# EAGLE board ESP32_C6_Sparrow (EAGLE 9.7.0)
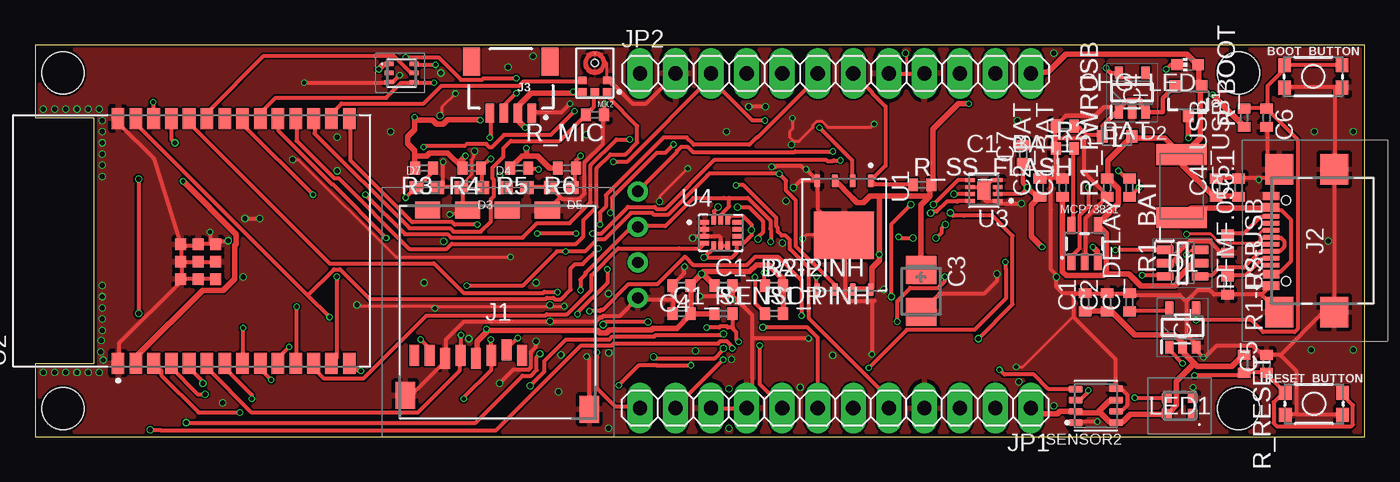
[diagram p1: board, top side]
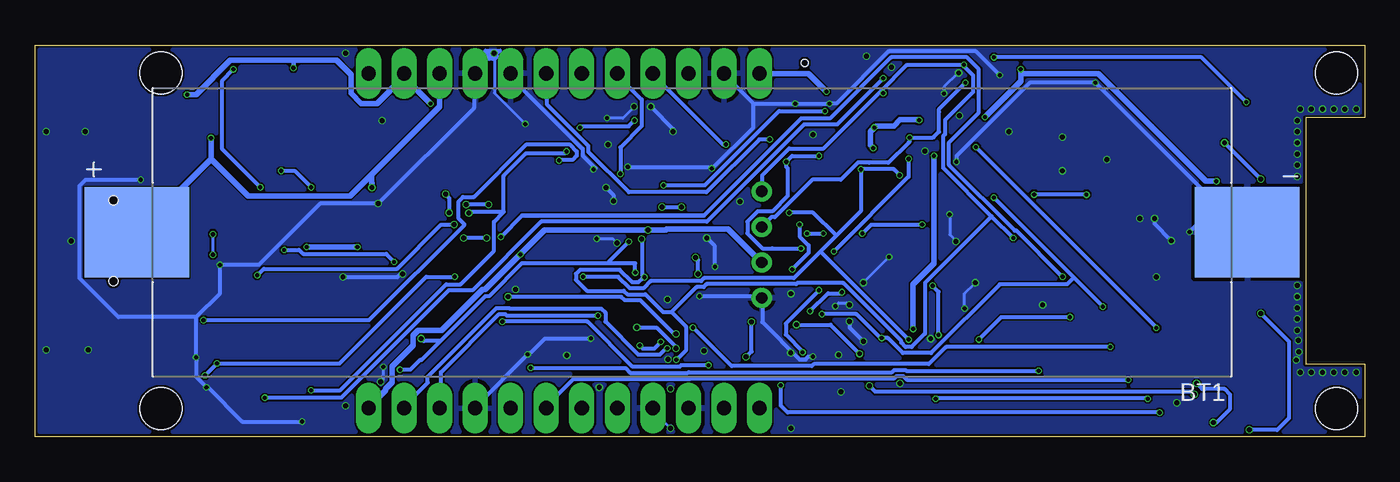
[diagram p2: board, bottom side, seen from below]

Size 95 x 28 mm. Coordinates in mm from the lower left corner, seen from the top.
Outline: 0,28 0,22.8 4.2,22.8 4.2,5.2 0,5.2 0,0 95,0 95,28 0,28
Copper layers (1*16): Top / Bottom
Stack-up Default Layer Stack: Top User Defined 0.035mm / Dielectric-1 User Defined 1.6mm / Bottom User Defined 0.035mm
Design rules: minimum copper width classes=1 0.2mm, minimum copper width 5mil, minimum drill size classes=1 0.3mm, minimum drill size 0.3mm, copper clearance wire_polygon to wire_polygon 5mil, copper clearance wire_polygon to pad_smd 5mil, copper clearance wire_polygon to via 5mil, copper clearance pad_smd to pad_smd 5mil, copper clearance pad_smd to via 5mil, copper clearance via to via 5mil, copper clearance smd to pad (same net) 5mil, copper clearance smd to via (same net) 5mil, copper clearance smd to smd (same net) 5mil, dimension clearance 0.1mm, via restrict clearance 0mil, restrict clearance 0mil, drill distance 6mil, keepout clearance 0mil
Net classes: 1 HIGH_CURRENT: width 0.2 mm, drill 0.3 mm
Holes 3 mm at 2,26 86,26 86,2 2,2

## Footprints (pad centres in the part's own frame; a part is rotated, then mirrored left to right if it is on the bottom)
ESP32_WROVER_SPARKFUN-SWITCHES_TACTILE_SWITCH_SMD_4.6X2.8MM = smd 0.9 x 1: 1 -2.05,-0.8; 2 2.05,-0.8; 3 2.05,0.8; 4 -2.05,0.8
BAT_1042P = smd 7.46 x 6.47: N -39.67,0; P 39.67,0
ESP32_WROVER_EAGLE-LTSPICE_C0402 = smd 0.7 x 0.9: 1 -0.65,0; 2 0.65,0
RCL_CT3528 = smd 2 x 2.2: + -1.5,0; - 1.5,0
ADAFRUIT_CHIP-LED0603 = smd 0.8 x 0.8: A 0,-0.75; C 0,0.75
SOT95P280X145-6N = smd 1.2 x 0.6: 1 -1.25,0.95; 2 -1.25,0; 3 -1.25,-0.95; 4 1.25,-0.95; 5 1.25,0; 6 1.25,0.95
ESP32_WROVER_AVX---SD0805S020S1R0_AVX_SD0805S020S1R0_0 = smd 0.8 x 0.9: 1 -1.05,0; 2 1.05,0
DIOC1608X36N = smd 0.97 x 0.94: 1 -0.75,0; 2 0.75,0
SOT95P280X125-5N = smd 0.9 x 0.6: 1 -1.4,0.95; 2 -1.4,0; 3 -1.4,-0.95; 4 1.4,-0.95; 5 1.4,0.95
SOT95P280X120-5N = smd 0.9 x 0.6: 1 -1.4,0.95; 2 -1.4,0; 3 -1.4,-0.95; 4 1.4,-0.95; 5 1.4,0.95
SAMACSYS_PARTS_112ATAARR03ATTEND = smd 1.8 x 1.2: G1 10.6,10.4; G2 4.9,10.4; S1 7.75,10.4; S2 2.05,10.4 | smd 1.4 x 1.9: G3 13.6,-3.85; G4 0.45,-2.85 | smd 0.7 x 1.5: P1 8.8,0; P2 7.7,0.4; P3 6.6,0; P4 5.5,-0.2; P5 4.4,0; P6 3.3,-0.2; P7 2.2,0; P8 1.1,0
SAMACSYS_PARTS_USB4110GFA = smd 0.3 x 1.15: A1 -3.35,3.678; A4 -2.55,3.678; A5 -1.25,3.678; A6 -0.25,3.678; A7 0.25,3.678; A8 1.25,3.678; A9 2.55,3.678; A12 3.35,3.678; B1 3.05,3.678; B4 2.25,3.678; B5 1.75,3.678; B6 0.75,3.678; B7 -0.75,3.678; B8 -1.75,3.678; B9 -2.25,3.678; B12 -3.05,3.678 | smd 2.18 x 2: MP1 -5.11,-0.827; MP2 5.11,-0.827; MP3 -5.11,3.103; MP4 5.11,3.103 | hole 0.65: -2.89,2.603; 2.89,2.603
JST04_1MM_RA = smd 0.6 x 1.35: 1 -1.5,0; 2 -0.5,0; 3 0.5,0; 4 1.5,0 | smd 1.2 x 2: NC1 2.8,-3.675; NC2 -2.8,-3.675
1X12 = drill 1.016 long: 1 -13.97,0; 2 -11.43,0; 3 -8.89,0; 4 -6.35,0; 5 -3.81,0; 6 -1.27,0; 7 1.27,0; 8 3.81,0; 9 6.35,0; 10 8.89,0; 11 11.43,0; 12 13.97,0
SAMACSYS_PARTS_WS2812B2020 = smd 0.7 x 0.7: 1 0.915,-0.55; 2 0.915,0.55; 3 -0.915,0.55; 4 -0.915,-0.55
ESP32_WROVER_SAMACSYS_PARTS_LTR303ALS01 = smd 0.3 x 0.65: 1 -0.65,-0.9; 2 0,-0.9; 3 0.65,-0.9; 4 0.65,0.9; 5 0,0.9; 6 -0.65,0.9
ESP32_WROVER_SPARKFUN-IC-POWER_SOT23-5 = smd 0.55 x 1.2: 1 -0.95,-1.3; 2 0,-1.3; 3 0.95,-1.3; 4 0.95,1.3; 5 -0.95,1.3
MIC_ICS-43434 = smd 0.6 x 0.522: 1 -0.9,1.361; 2 -0.9,0.539; 4 0.9,0.539; 5 0.9,1.361; 6 0,1.361 | smd 0.1 x 0.1: 3 -0.015,-1.383 | hole 0.5: 0,-0.713
ESP32C6_VARISTOR_CT/CN1812 = smd 1.5 x 3.6: 1 -2.25,0; 2 2.25,0
ESP32_WROVER_SPARKFUN-DISCRETESEMI_SOT23-3 = smd 0.8 x 0.9: 1 -0.95,-1; 2 0.95,-1; 3 0,1.1
ESP32_WROVER_EAGLE-LTSPICE_R0402 = smd 0.7 x 0.9: 1 -0.65,0; 2 0.65,0
ESP32_WROVER_BME680_PSON80P300X300X100-8N = smd 1.016 x 0.5: 1 1.458,1.2; 2 1.458,0.4; 3 1.458,-0.4; 4 1.458,-1.2; 5 -1.458,-1.22; 6 -1.458,-0.4; 7 -1.458,0.4; 8 -1.458,1.2
SON127P600X800X80-9N = smd 0.94 x 0.44: 1 -3.895,1.905; 2 -3.895,0.635; 3 -3.895,-0.635; 4 -3.895,-1.905; 5 3.895,-1.905; 6 3.895,-0.635; 7 3.895,0.635; 8 3.895,1.905 | smd 3.4 x 4.3: 9 0,0
XCVR_ESP32-C6-WROOM-1-N8 = smd 1.5 x 0.9: 1 -8.75,5.26; 2 -8.75,3.99; 3 -8.75,2.72; 4 -8.75,1.45; 5 -8.75,0.18; 6 -8.75,-1.09; 7 -8.75,-2.36; 8 -8.75,-3.63; 9 -8.75,-4.9; 10 -8.75,-6.17; 11 -8.75,-7.44; 12 -8.75,-8.71; 13 -8.75,-9.98; 14 -8.75,-11.25; 15 8.75,-11.25; 16 8.75,-9.98; 17 8.75,-8.71; 18 8.75,-7.44; 19 8.75,-6.17; 20 8.75,-4.9; 21 8.75,-3.63; 22 8.75,-2.36; 23 8.75,-1.09; 24 8.75,0.18; 25 8.75,1.45; 26 8.75,2.72; 27 8.75,3.99; 28 8.75,5.26 | smd 0.8 x 0.8: 29_1 -2.755,0.79; 29_2 -1.505,0.79; 29_3 -0.255,0.79; 29_4 -2.755,-0.46; 29_5 -1.505,-0.46; 29_6 -0.255,-0.46; 29_7 -2.755,-1.71; 29_8 -1.505,-1.71; 29_9 -0.255,-1.71
SON50P200X200X80-9N = smd 0.76 x 0.27: 1 -0.985,0.75; 2 -0.985,0.25; 3 -0.985,-0.25; 4 -0.985,-0.75; 5 0.985,-0.75; 6 0.985,-0.25; 7 0.985,0.25; 8 0.985,0.75 | smd 0.9 x 1.3: 9 0,0
PQFN50P300X250X86-14N = smd 0.61 x 0.35: 1 -1.16,0.75; 2 -1.16,0.25; 3 -1.16,-0.25; 4 -1.16,-0.75; 8 1.16,-0.75; 9 1.16,-0.25; 10 1.16,0.25; 11 1.16,0.75 | smd 0.35 x 0.61: 5 -0.5,-0.91; 6 0,-0.91; 7 0.5,-0.91; 12 0.5,0.91; 13 0,0.91; 14 -0.5,0.91
SIP = drill 0.8: P$1 -17.55,-4.16; P$2 -17.55,-1.62; P$3 -17.55,0.92; P$4 -17.55,3.46

## Placement (x,y rotation side)
BOOT_BUTTON  [ESP32_WROVER_SPARKFUN-SWITCHES_TACTILE_SWITCH_SMD_4.6X2.8MM]  91.34,25.74 0 top
BT1  1042P  [BAT_1042P]  48.05,14.6 180 bottom
C1  100nF  [ESP32_WROVER_EAGLE-LTSPICE_C0402]  75.03,9.6 90 top
C1_BAT  4.7uF  [ESP32_WROVER_EAGLE-LTSPICE_C0402]  73.43,17.8 90 top
C1_BAT1  4.7uF  [ESP32_WROVER_EAGLE-LTSPICE_C0402]  73.6,22.2 180 top
C1_BAT2  4.7uF  [ESP32_WROVER_EAGLE-LTSPICE_C0402]  49.2,10.8 0 top
C1_SENSOR  100nF  [ESP32_WROVER_EAGLE-LTSPICE_C0402]  46.2,8.8 0 top
C2  100nF  [ESP32_WROVER_EAGLE-LTSPICE_C0402]  76.6,9.6 90 top
C2_BAT  4.7uF  [ESP32_WROVER_EAGLE-LTSPICE_C0402]  71.8,17.8 90 top
C3  100uF TANT  [RCL_CT3528]  63.32,10.4 270 top
C4  100nF  [ESP32_WROVER_EAGLE-LTSPICE_C0402]  46.2,10.8 180 top
C4_USB  100nF  [ESP32_WROVER_EAGLE-LTSPICE_C0402]  84.4,17.8 90 top
C5  1uF  [ESP32_WROVER_EAGLE-LTSPICE_C0402]  88,5.2 90 top
C5_USB  4.7uF  [ESP32_WROVER_EAGLE-LTSPICE_C0402]  86,17.8 90 top
C6  100nF  [ESP32_WROVER_EAGLE-LTSPICE_C0402]  88,22.8 270 top
C7  100nF  [ESP32_WROVER_EAGLE-LTSPICE_C0402]  70.6,20.2 90 top
C_DELAY  100nF  [ESP32_WROVER_EAGLE-LTSPICE_C0402]  78.2,9.6 90 top
CHG_LED  [ADAFRUIT_CHIP-LED0603]  82.35,26.59 90 top
D1  USBLC6-2SC6Y  [SOT95P280X145-6N]  82,12.4 0 top
D2  ESP32_WROVER_AVX---SD0805S020S1R0_AVX_SD0805S020S1R0AVX_SD0805S020S1R0_0_0  [ESP32_WROVER_AVX---SD0805S020S1R0_AVX_SD0805S020S1R0_0]  77.32,21.46 0 top
D3  PGB1010603MR  [DIOC1608X36N]  31.2,17.8 180 top
D4  PGB1010603MR  [DIOC1608X36N]  34.4,17.8 0 top
D5  PGB1010603MR  [DIOC1608X36N]  37.6,17.8 180 top
D7  PGB1010603MR  [DIOC1608X36N]  28,17.8 0 top
IC1  BD5229G-TR  [SOT95P280X125-5N]  82,7.8 90 top
IC4  XC6220A331MR-G  [SOT95P280X120-5N]  78.4,24.6 90 top
J1  SAMACSYS_PARTS_112A-TAAR-R03_ATTEND  [SAMACSYS_PARTS_112ATAARR03ATTEND]  26,5.8 0 top
J2  SAMACSYS_PARTS_USB4110-GF-A  [SAMACSYS_PARTS_USB4110GFA]  92,14 90 top
J3  QWIIC_RIGHT_ANGLE  [JST04_1MM_RA]  34,23.12 180 top
JP1  PINHD-1X12  [1X12]  57.2,2.03 180 top
JP2  PINHD-1X12  [1X12]  57.2,25.97 0 top
LED1  SAMACSYS_PARTS_WS2812B-2020  [SAMACSYS_PARTS_WS2812B2020]  81.8,2.2 0 top
LED2  ESP32_WROVER_SAMACSYS_PARTS_LTR-303ALS-01  [ESP32_WROVER_SAMACSYS_PARTS_LTR303ALS01]  26.2,26 270 top
MCP73831  ESP32_WROVER_SPARKFUN-IC-POWER_MCP73831  [ESP32_WROVER_SPARKFUN-IC-POWER_SOT23-5]  75,13.8 0 top
MK2  ICS-43434  [MIC_ICS-43434]  40,26 180 top
PFMF.050.1  ESP32C6_VARISTORCN1812  [ESP32C6_VARISTOR_CT/CN1812]  81.93,17.9 270 top
Q1  20V/4.2A/52mΩ/1.4W  [ESP32_WROVER_SPARKFUN-DISCRETESEMI_SOT23-3]  82.41,24.05 180 top
R1  10K  [ESP32_WROVER_EAGLE-LTSPICE_R0402]  49.2,8.8 0 top
R1-USB  5k1  [ESP32_WROVER_EAGLE-LTSPICE_R0402]  85.2,10.8 270 top
R1_BAT  200  [ESP32_WROVER_EAGLE-LTSPICE_R0402]  78.2,17.8 270 top
R1_PINH  10K  [ESP32_WROVER_EAGLE-LTSPICE_R0402]  52.8,8.8 0 top
R1_PWRUSB  100K  [ESP32_WROVER_EAGLE-LTSPICE_R0402]  76.6,17.8 90 top
R2-PINH  10K  [ESP32_WROVER_EAGLE-LTSPICE_R0402]  52.8,10.8 0 top
R2-USB  5k1  [ESP32_WROVER_EAGLE-LTSPICE_R0402]  85.2,13.8 270 top
R2_BAT  2K  [ESP32_WROVER_EAGLE-LTSPICE_R0402]  73.6,20.6 0 top
R3  10K  [ESP32_WROVER_EAGLE-LTSPICE_R0402]  27.8,19.2 180 top
R4  10K  [ESP32_WROVER_EAGLE-LTSPICE_R0402]  31.2,19.2 180 top
R5  10K  [ESP32_WROVER_EAGLE-LTSPICE_R0402]  34.6,19.2 180 top
R6  10K  [ESP32_WROVER_EAGLE-LTSPICE_R0402]  38,19.2 180 top
R_BOOT  10K  [ESP32_WROVER_EAGLE-LTSPICE_R0402]  86.4,22.8 90 top
R_MIC  100k  [ESP32_WROVER_EAGLE-LTSPICE_R0402]  40,23 180 top
R_RESET  10K  [ESP32_WROVER_EAGLE-LTSPICE_R0402]  86.4,5.2 270 top
R_SS_FLASH  10K  [ESP32_WROVER_EAGLE-LTSPICE_R0402]  63.4,18 0 top
RESET_BUTTON  [ESP32_WROVER_SPARKFUN-SWITCHES_TACTILE_SWITCH_SMD_4.6X2.8MM]  91.39,2.34 0 top
SENSOR2  BME680  [ESP32_WROVER_BME680_PSON80P300X300X100-8N]  75.8,2.2 180 top
U1  W25Q512JVEIQ  [SON127P600X800X80-9N]  57.8,14.4 270 top
U2  ESP32-C6-WROOM-1-N8  [XCVR_ESP32-C6-WROOM-1-N8]  11.2,14 90 top
U3  MAX17048G+T10  [SON50P200X200X80-9N]  67.8,17.6 180 top
U4  LSM6DSL  [PQFN50P300X250X86-14N]  49,14.57 0 top
U$1  OLED  [SIP]  60.62,14.07 0 top

## Tracks (layer width: path | path; a pad name or v marks a point on that pad's centre or on a via)
3V3  (via drill 0.3, 0.35)
  Top 0.3: U4.5 48.5,13.5 v47.8,12.8 49.8,12.8 50.16,13.16 U4.8 50.62,13.82 51,14.2 51.2,14.4 v51.2,14.78 51.2,15.15 50.55,15.8 50.4,15.8 49.77,15.8 49.58,15.61 49.58,15.56 U4.12
  Top 0.305: v76.54,26.35 76.89,26 IC4.5
  Top 0.4: 35.13,20.07 34.81,20.07 33.96,19.21 R5.2 | 38.44,24.55 35.45,24.55 34.6,23.7 34.6,23.16 J3.2 34.6,22.95 34.6,22.52 v35.03,22.1 | 38.44,24.55 39.08,24.55 MK2.5 | 35.13,20.07 35.13,20.6 v35.11,20.62 | v38.44,24.66 38.44,24.55 | v24.57,26.26 24.89,26.58 25.21,26.58 LED2.1 | 27.13,20.07 27.13,19.21 R3.2 | 27.13,22.63 v27.13,22.84 | 27.13,20.07 27.98,20.07 28.2,20.28 29.48,20.28 30.54,19.21 R4.2 30.33,19.64 v30.76,20.07 | U2.2 7.27,5.34 7.27,5.76 11.97,10.46 13.46,10.46 14.28,11.28 14.28,13.66 14.38,13.76 14.38,14.46 v10.58,18.25 | U1.7 58.51,10.57 59.69,10.57 U1.8 59.79,10.68 59.79,12.06 60.33,12.6 v60.33,13.02 60.33,17.19 | 63.96,17.19 63.96,17.93 R_SS_FLASH.2 64.17,18.15 64.17,21.99 65.98,23.8 v66.73,23.8 | 63.96,17.19 60.33,17.19 | v84.13,24.45 86.37,22.2 R_BOOT.1 | C1.1 75.06,8.97 76.55,8.97 C2.1 76.77,8.86 76.98,8.86 78.58,7.26 81.46,7.26 81.89,6.83 81.89,6.51 IC1.2 82.1,6.3 82.1,5.98 82.85,5.23 | 82.85,5.23 83.06,5.02 85.52,5.02 86.37,5.87 R_RESET.1 | 76.02,1.71 76.13,1.71 76.77,1.07 77.09,1.07 SENSOR2.8 77.3,1.07 77.73,1.07 78.26,1.6 80.82,1.6 LED1.4 81.04,1.71 81.57,2.24 81.57,3.95 82.85,5.23 | 76.02,1.71 74.42,1.71 SENSOR2.2 73.22,1.8 73.04,1.62 71.62,1.62 71.22,2.03 JP1.1 | SENSOR2.6 77.19,2.56 76.77,2.56 76.02,1.81 76.02,1.71 | R1_PINH.2 53.49,8.86 53.49,10.78 R2-PINH.2 53.49,10.99 53.49,11.24 52.45,12.28 51.55,12.28 51.07,11.79 47.78,11.79 v47.62,11.64 | C1_SENSOR.2 46.88,8.75 48.48,8.75 R1.1 | v47.62,11.64 46.88,10.89 C4.1 46.88,10.68 46.88,8.97 C1_SENSOR.2 | C1_BAT2.1 48.48,10.89 47.73,11.64 v47.62,11.64 | C1_SENSOR.2 46.77,8.65 45.87,7.74 44.16,7.74 44.04,7.62 41.04,7.62 40.84,7.42 40.36,7.42 40.18,7.6 32.38,7.6 32.36,7.58
  Top 0.4: 32.36,7.58 v32.25,7.69 | 32.36,7.58 31.58,6.8 31.58,5.68 J1.P4 | U1.3 57.19,18.3 58.41,17.07 58.41,17.05 58.74,16.72 59.2,16.72 59.66,17.19 60.33,17.19 | 63.96,17.19 63.32,16.55 C3.+ | 35.13,20.07 35.91,20.07 36.78,19.2 R6.2 | 27.13,22.63 28.42,22.63 28.69,22.35 29.17,22.35 29.47,22.65 31.64,22.65 31.66,22.63 v31.82,22.63 | 27.13,20.07 27.13,20.45 26.62,20.96 26.62,21.44 27.13,21.95 27.13,22.63
  Bottom 0.3: v47.62,11.64 47.62,12.62 v47.8,12.8
  Bottom 0.305: 76.54,26.9 v76.54,26.35
  Bottom 0.4: v38.44,24.66 39.72,25.94 43.14,25.94 JP2.1 | 24.57,25.94 24.57,25.41 v27.13,22.84 | 24.57,25.94 v24.57,26.26 | v10.58,18.25 11.33,18.25 19.02,25.94 24.57,25.94 | v84.13,24.45 83.49,24.45 81.04,26.9 76.54,26.9 73.44,26.9 72.41,25.87 72.41,24.54 71.68,23.82 70.56,23.82 68.65,25.73 68.65,25.94 JP2.11 68.55,25.62 v66.73,23.8 | U$1.P$2 43.14,12.49 45.49,14.84 47.11,14.84 48.11,14.84 49.87,14.84 49.93,14.78 v51.2,14.78 58.57,14.78 v60.33,13.02 62.84,10.51 63.02,10.51 65.96,7.58 67.64,7.58 67.98,7.24 67.98,6.5 69.47,5.01 69.47,3.88 69.94,3.42 69.94,3.31 71.11,2.13 JP1.1 | v30.76,20.07 30.76,12.38 32.25,10.89 v32.25,7.69 | v35.11,20.62 35.31,20.82 35.31,21.81 v35.03,22.1 34.92,22.2 33.64,22.2 33.19,22.65 31.96,22.65 31.94,22.63 v31.82,22.63
DN
  Top 0.3: J2.A7 88.4,14.2 89.04,14.2 89.26,13.98 89.26,13.56 88.94,13.24 88.4,13.24 J2.B7 88.19,13.24 87.55,13.24 86.39,12.08 84.63,12.08 84.09,11.53 83.28,11.53 D1.4
DP  (via drill 0.3)
  Top 0.2: 87.52,13.98 87.68,13.82 88.25,13.82 J2.A6 | 87.52,13.98 87.52,14.55 87.68,14.71 88.25,14.71 J2.B6 | v82.29,13 82.61,13.32 83.19,13.32 D1.6 | v82.29,14.47 84,14.47 84.66,13.82 87.27,13.82 87.44,13.98 87.52,13.98
  Bottom 0.2: v82.29,14.47 v82.29,13
FLASH_CS  (via drill 0.3)
  Top 0.3: R_SS_FLASH.1 62.68,18.04 60.01,18.04 59.79,18.25 U1.1 60.78,19.37 60.78,23.6 59.82,24.56 59.82,24.62 JP2.7 | v19.87,17.29 14.85,22.31 14.85,22.74 U2.21 | v42.5,21.24 41.54,21.24 39.7,19.41 39.7,16.76 38.21,15.27 35.88,15.27 34.84,14.23 29.72,14.23 29.48,14.47 26.43,14.47 v23.61,17.29
  Bottom 0.3: v19.87,17.29 v23.61,17.29 | v42.5,21.24 43.25,21.24 47.02,17.47 52.56,17.47 55.45,20.35 55.45,20.77 58.41,23.73 58.41,25.94 JP2.7
GND  (via drill 0.3, 0.35)
  Top 0.2: MK2.2 40.84,25.59 40.84,26.73 40.18,27.39 MK2.3 | 28.58,9.32 23.02,9.32 v23,9.4 | 28.58,9.32 v37.81,9.32 | 62.26,25.94 62.26,27.39 v62.2,27.4 | D3.2 30.54,17.9 30.54,18.07 31.19,18.72 31.19,19.78 31.36,19.95 31.36,20.36 v31.4,20.4 | v28.58,9.16 28.58,9.32 | v30.05,24.52 29.07,23.54 29.07,23.07 v28.93,22.93 | v70.11,4.99 70.6,4.99 74.11,8.5 74.2,8.54 | v33.97,12.84 25.8,12.84 18.85,19.78 18.44,19.78 v18.4,19.8 | J1.G2 30.22,16.2 29.91,15.88 v29.64,15.88 | v59.96,22.35 59.74,22.12 56.66,22.12 56.24,22.54 55.86,22.54 55.6,22.27 55.6,22.12 54.6,21.12 54.2,21.12 54.16,21.16 | 54.16,21.16 54.05,21.05 v54.05,20.87 | 54.16,21.16 53.92,21.4 53.92,21.8 54.13,22 v54.13,22.76 | v46.64,19.17 44.63,17.16 v44.63,16.8 | U1.9 55.12,14.4 v54.87,14.14
  Top 0.3: 12.5,13.77 12.82,13.77 U2.29_9 13.17,14 v13.8,14 | 12.5,13.77 11.76,13.77 U2.29_6 11.54,13.66 10.58,13.66 U2.29_3 | U2.29_1 10.48,11.32 10.48,12.49 U2.29_2 | U2.29_3 10.48,13.66 10.48,12.6 U2.29_2 | U2.29_1 10.58,11.32 11.65,11.32 U2.29_4 11.76,11.32 12.82,11.32 U2.29_7 | U2.29_2 10.58,12.49 U2.29_5 11.76,12.49 12.82,12.49 U2.29_8 | U2.28 5.99,22.74 5.99,22.38 8.47,19.9 U2.29_3 | 37.54,17.13 36.95,17.72 D5.2 36.73,17.83 35.24,17.83 D4.2 | 37.54,17.13 37.7,16.97 38.87,16.97 39.28,17.38 39.28,19.62 40.58,20.92 40.58,22.95 R_MIC.1 40.68,23.06 v40.68,23.8 | 37.54,17.13 36.63,16.23 J1.G1 | MK2.2 41.01,25.41 41.22,25.19 41.33,25.19 42.71,23.8 43.67,23.8 45.81,25.94 JP2.2 | v38.23,23.8 37.59,23.16 35.56,23.16 J3.1 | J1.G2 30.86,16.23 30.54,16.55 30.54,17.72 D3.2 30.44,17.83 28.84,17.83 D7.2 29.16,17.93 v29.16,19.64 | v19.23,25.3 25.21,25.3 LED2.3 25.42,25.41 25.63,25.41 v26.06,25.83 | v12.5,14.62 12.5,13.77 | MCP73831.2 75.06,12.6 75.06,15.59 76.55,17.08 R1_PWRUSB.1 76.55,17.29 74.95,18.89 74.95,21.14 74.74,21.35 72.92,21.35 | 72.92,21.35 72.92,22.1 C1_BAT1.2 73.03,22.31 73.67,22.95 | 72.92,21.35 72.92,20.6 R2_BAT.1 72.92,20.5 72.92,18.47 | 72.92,18.47 73.35,18.47 C1_BAT.2 | 72.92,18.47 72.6,18.47 | 72.6,18.47 71.86,18.47 C2_BAT.2 | SENSOR2.7 77.3,1.81 77.62,1.81 78.05,2.24 78.05,2.99 77.62,3.42 77.3,3.42 SENSOR2.5 77.19,3.52 77.19,5.55 74.2,8.54 74.2,9.8 74.2,10.25 | 74.2,10.25 74.95,10.25 C1.2 75.16,10.25 76.55,10.25 C2.2 76.66,10.25 78.16,10.25 C_DELAY.2 78.26,10.14 81.78,10.14 82.21,9.71 82.32,9.71 | 74.2,10.25 73.46,10.25 73,10.71 73,11.54 | 92.89,24.98 93.31,24.98 BOOT_BUTTON.2
  Top 0.3: 92.89,24.98 89.36,24.98 BOOT_BUTTON.1 | 92.89,24.98 92.89,19.21 J2.MP2 92.89,19 92.89,8.97 J2.MP1 92.78,8.86 92.03,8.86 89.04,5.87 | C4_USB.2 84.45,18.47 85.95,18.47 C5_USB.2 86.05,18.47 87.44,18.47 | J2.B1 88.3,17.08 88.3,17.29 J2.A12 88.4,17.4 88.4,18.57 88.83,19 J2.MP4 | C6.2 88.08,22.1 88.08,19.96 88.83,19.21 J2.MP4 | 87.44,18.47 88.3,18.47 J2.MP4 | 88.3,10.78 88.3,10.89 J2.B12 | 88.3,10.78 J2.A1 | J2.MP3 88.83,8.97 88.4,9.39 88.4,9.4 87.6,10.2 | 81.41,12.65 81.25,12.49 80.82,12.49 D1.2 | 81.41,12.65 81.68,12.92 81.68,13.13 82.53,13.98 83.92,13.98 84.67,13.24 85.2,13.24 R2-USB.2 | 90.11,1.6 93.42,1.6 RESET_BUTTON.2 | 90.11,1.6 89.36,1.6 RESET_BUTTON.1 | v82.74,3.52 82.74,2.78 LED1.2 | v75.91,1.07 74.42,1.07 SENSOR2.1 | 89.04,5.87 88.08,5.87 C5.2 87.97,5.87 87.66,5.87 87.02,6.51 84.45,6.51 83.6,5.66 v83.49,5.66 82.85,6.3 IC1.3 82.85,6.51 82.85,6.72 82.32,7.26 82.32,9.71 | 90.11,1.6 90.11,4.7 89.04,5.76 89.04,5.87 | v81.78,12.28 81.41,12.65 | 82.32,9.71 83.06,10.46 83.94,10.46 84,10.4 84.25,10.15 R1-USB.2 85.25,10.2 87.6,10.2 | v87.44,18.36 87.44,18.47 | 49.87,10.03 49.87,10.78 C1_BAT2.2 | 49.87,10.03 51.25,8.65 51.25,7.04 | 51.25,7.04 51.25,2.46 50.93,2.13 JP1.9 50.72,2.03 48.37,2.03 JP1.10 | 45.6,9.82 45.6,10.68 C4.2 45.6,10.89 46.38,11.68 46.38,12.11 v46.41,12.14 | 45.6,9.82 45.6,8.86 C1_SENSOR.1 | J1.G4 26.49,2.99 26.91,2.99 29.26,5.34 29.26,5.55 J1.P6 29.37,5.66 29.37,6.94 30.65,8.22 v36.8,8.22 40.07,8.22 40.38,8.53 40.52,8.53 40.62,8.63 41.79,8.63 U$1.P$1 43.14,9.82 45.6,9.82 | 49.87,10.03 v47.52,10.03 | U1.4 55.95,18.25 55.95,16.23 57.77,14.41 U1.9 57.87,14.3 57.87,9.93 58.08,9.71 59.79,9.71
  Top 0.3: 59.79,9.71 60.01,9.71 | 59.79,9.71 v59.79,5.87 | JP2.9 63.53,25.94 62.26,25.94 61.07,25.94 JP2.8 | U1.4 55.84,18.36 v55.1,19.11 54.99,19.11 54.78,19.32 52.96,19.32 52.93,19.29 v52.64,19.29 | U2.29_1 10.41,11.06 5.99,6.64 5.99,5.34 U2.1 5.94,4.73 | C3.- 64.62,10.2 64.71,10.2 67.8,10.2 68.74,11.14 v68.74,11.63 | 78.11,25.51 78.15,25.51 | v52.2,23.6 v51,23.6 | v15,15.6 v16.06,15.6 | 87.6,10.2 87.71,10.2 88.3,10.78 | U3.4 68.4,18.35 68.13,18.08 68.13,17.93 U3.9 67.55,17.85 U3.6 | 67.8,17 67.95,16.85 U3.1 68.98,16.65 v70.48,16.65 | v73,11.4 73,11.54 | 73,11.54 72.6,11.93 72.6,16.2 72.6,18.47 | 51.25,7.04 55.24,7.04 v55.28,7.01 | v39.42,5.72 39.6,5.54 J1.G3 | v35.8,6.8 35.8,6.4 35.43,6.03 35.43,4.93 35.27,4.77 34.17,4.77 v33.2,3.8 | v47,14.2 47.12,14.32 U4.3 | U4.3 U4.2 U4.1 | U4.7 U4.6 49,14.2 48.88,14.32 U4.3 | U1.4 54.7,18.3 v54.2,17.8
  Top 0.305: 78.11,25.51 78.1,25.5 78.03,25.5 | 76.69,23.54 76.36,23.54 75.77,22.95 73.67,22.95
  Bottom 0.2: v37.81,9.32 37.57,9.56 36.95,9.56 v36.8,9.4 | v62.2,27.4 62.26,27.39 62.67,27.39 62.83,27.55 62.83,27.63 61.77,27.63 61.77,27.55 62.34,26.98 62.5,26.98 62.58,27.06 62.58,27.3 62.09,27.3 61.93,27.47 61.93,27.55 62.67,27.55 62.67,27.47 62.75,27.39 62.67,27.3 62.67,27.06 62.58,26.98 62.34,27.22 62.17,27.22 62.01,27.06 61.93,27.14 61.93,27.22 62.01,27.22 62.01,27.14 62.17,26.98 62.26,26.98 62.34,27.06 62.34,27.14 62.26,27.14 62.09,26.98 62.17,26.9 62.17,24.56 v59.96,22.35 | JP1.9 50.81,1.96 50.81,1.8 49.67,0.65 v49.6,0.6 | v28.58,9.16 28.58,10.22 27.84,10.95 v27.8,11 | v30.05,24.52 30.05,25.02 29.07,26 v29,26 | v54.13,22.76 52.98,22.76 52.2,23.54 v52.2,23.6 | v70.11,4.99 70.11,4.09 70.27,3.92 v70.3,3.9 | v33.97,12.84 35.77,11.04 v35.8,11 | v29.2,13.94 29.2,14 29.64,14.44 v29.64,15.88 | v46.64,19.17 46.6,19.21 46.56,19.21 | v53.41,13.84 53.71,14.14 v54.87,14.14
  Bottom 0.3: 43.67,23.8 v40.68,23.8 v38.23,23.8 37.75,23.8 34.01,27.54 27.77,27.54 v26.06,25.83 | 43.67,23.8 45.81,25.94 JP2.2 | v29.16,19.64 29.16,20.07 23.93,25.3 v19.23,25.3 8.45,14.52 BT1.N 10.58,16.55 v12.5,14.62 | v75.91,1.07 80.18,1.07 82.64,3.52 v82.74,3.52 83.49,4.27 v83.49,5.66 83.49,8.54 | 83.49,8.54 81.78,10.25 v81.78,12.28 79.01,12.28 74.63,16.65 v70.48,16.65 63.64,23.5 63.64,25.94 JP2.9 | v87.44,18.36 91.39,18.36 91.82,17.93 91.82,11.32 89.04,8.54 83.49,8.54 | v47.52,10.03 43.14,10.03 U$1.P$1 43.03,9.82 43.03,8.19 40.36,5.51 39.94,5.51 39.74,5.72 v39.42,5.72 | JP1.4 63.53,2.13 v59.79,5.87 59.69,5.87 58.55,7.01 v55.28,7.01 | JP2.8 60.97,25.94 60.97,25.66 55.87,20.56 55.87,20.1 54.94,19.16 54.99,19.11 v55.1,19.11 | 43.67,23.8 43.67,22.1 46.56,19.21 52.56,19.21 v52.64,19.29 | v51,23.6 49.4,22 v49.4,21.8 | v13.8,14 15,15.2 v15,15.6 | v68.74,11.63 68.88,11.63 69.12,11.4 v73,11.4 | v36.8,8.22 36.8,7.8 v35.8,6.8 | v46.41,12.14 46.41,13.61 v47,14.2 | v54.2,17.8 53.67,17.27 v53.67,16.84
  other vias: 0.6,23.4 1.4,23.4 2.2,23.4 3,23.4 3.8,23.4 4.6,23.4 4.8,22.6 4.8,21.8 4.8,21 4.8,20.2 4.8,19.4 4.8,18.6 4.8,10.8 4.8,10 4.8,9.2 4.8,8.4 4.8,7.6 4.6,4.6 3.8,4.6 3,4.6 2.2,4.6 1.4,4.6 0.6,4.6 25.4,21.8 21.6,21.4 21.6,19 57,5.8 72.8,27.4 72.8,2.2 35.6,27.2 39.4,21.6 33.8,26.4 31,7 49.8,9.8 37.4,3.2 49.6,3.4 54.68,3.52 70.21,22.59 4.73,6.87 4.7,6.05 4.87,5.47 14.87,11.4 60.67,10.53 47.2,6.13 49.78,5.52 40.98,0.58 37.57,5.83 41,5.99 13.4,2.4 40.99,10.21 94.21,21.79 91.41,21.79 94.21,6.19 91.21,6.19 92.41,13.99
  pour Top: 0,0 0,5.2 4.2,5.2 4.2,22.8 0,22.8 0,28
  pour Top: 95,0 0,0 0,5.2 4.2,5.2 4.2,22.8 0,22.8 0,28 95,28
  pour Bottom: 95,0 0,0 0,5.2 4.2,5.2 4.2,22.8 0,22.8 0,28 95,28
GPIO0  (via drill 0.3)
  Top 0.3: v38.55,23.27 36.84,21.56 35.2,21.56 33.51,21.56 32.62,20.67 32.49,20.67 32.23,20.93 30.86,20.93 30.71,20.77 27.85,20.77 v27.77,20.7 | JP1.5 60.97,2.13 60.97,2.78 55.31,8.43 55.31,12.04 53.93,13.41 53.93,14.06 53.63,14.37 53.36,14.37 53.08,14.65 53.08,14.91 52.97,15.02 52.97,15.63 50.64,17.97 v50.09,17.97 | U2.8 14.85,5.27 14.85,7.74 v14.88,7.77
  Bottom 0.3: v38.55,23.27 41.83,23.27 47.13,17.97 47.4,17.97 v50.09,17.97 | v14.88,7.77 14.88,7.81 v27.77,20.7
GPIO1  (via drill 0.3)
  Top 0.3: v16.88,4.06 16.13,4.8 16.13,5.23 U2.9
  Bottom 0.3: JP1.6 58.51,2.13 56.51,4.13 48.15,4.13 48.12,4.16 33.58,4.16 33.42,4.33 32.98,4.33 32.71,4.06 v16.88,4.06
GPIO5  (via drill 0.35)
  Top 0.3: JP1.7 55.93,7.07 55.6,7.4 55.2,7.8 v52,7.8 | v49.2,6.3 49.2,6.23 48.57,5.6 44.29,5.6 v44.2,5.69 | v43.8,8.2 40.8,8.2 v40.6,8 | v10.8,1 31.49,1 34.84,4.35 35.44,4.35 35.85,4.76 35.85,5.71 v36.07,5.93 | v12,3.8 12.03,3.8 12.03,3.92 11.02,4.93 U2.5
  Bottom 0.3: v52,7.8 50.6,7.8 49.2,6.4 v49.2,6.3 | v44.2,5.69 43.8,6.09 v43.8,8.2 | v12,3.8 11.6,3.4 11.4,3.4 10,3.4 9.6,3 9.6,2 10.6,1 v10.8,1 | v40.6,8 38.15,8 v36.07,5.93
GPIO8  (via drill 0.3)
  Top 0.3: 49.87,7.79 49.87,8.75 R1.2 | v51.79,6.51 51.79,3.74 53.39,2.13 JP1.8 | v18.16,6.41 17.41,5.66 17.41,5.34 U2.10 | 49.87,7.79 49.87,7.7 50.1,7.47 50.1,6.95 v50.28,6.77 | 49.87,7.79 49.51,7.79 49.42,7.88 48.98,7.88 48.89,7.79 v47.99,7.79
  Bottom 0.3: v51.79,6.51 51.57,6.3 50.75,6.3 v50.28,6.77 | v18.16,6.41 29.9,6.41 31.13,5.18 39.35,5.18 39.5,5.04 45.23,5.04 v47.99,7.79
INT1_ACCEL
  Top 0.3: U2.12 19.98,5.23 19.98,4.8 20.62,4.16 23.5,4.16 27.98,8.65 36.48,8.65 36.58,8.75 38.01,8.75 39.75,10.49 39.75,11.52 41.68,13.45 46.03,13.45 47.47,13.45 U4.4
INT_LTR
  Top 0.3: LED2.5 27.02,26.05 26.81,26.05 25.63,27.22 16.35,27.22 12.4,23.27 12.4,22.84 U2.23
INT_VLT  (via drill 0.35)
  Top 0.3: U2.4 9.69,5.19 9.69,4.99 11.68,3 12.15,3 v12.17,3.03 | v61.2,10 61.2,15.2 v62.6,16.6 | v64.2,16.6 65.95,18.35 U3.5 | v35.38,3.62 36.4,4.65 36.4,5.4 37.95,6.95 41.04,6.95 41.24,7.14 44.24,7.14 44.34,7.25 49.1,7.25 v49.2,7.35
  Bottom 0.3: v62.6,16.6 v64.2,16.6 | v35.38,3.62 34.95,3.2 12.35,3.2 v12.17,3.03 | v49.2,7.35 49.35,7.35 51.74,9.74 52.85,9.74 53.11,10 v61.2,10
IO/BOOT  (via drill 0.3)
  Top 0.3: R_BOOT.2 86.48,23.48 87.97,23.48 C6.1 | C6.1 88.08,23.59 88.08,25.09 89.26,26.26 89.26,26.47 BOOT_BUTTON.4 89.36,26.58 93.31,26.58 BOOT_BUTTON.3 | v38.66,14.52 v35.88,14.52 | v39.83,14.52 40.47,14.52 42.37,16.41 44.27,16.41 44.41,16.27 45.05,16.27 48.57,19.79 56.5,19.79 56.6,19.7 57.01,19.7 57.06,19.75 v57.55,19.75 | v82.96,8.33 86.91,8.33 87.76,7.47 90,7.47 90.22,7.69 90.22,21.24 88.08,23.38 C6.1 | U2.15 22.54,22.74 22.54,19.75 26.96,15.32 29.83,15.32 30,15.16 v31.61,15.16
  Bottom 0.3: v31.61,15.16 35.24,15.16 v35.88,14.52 | v39.83,14.52 v38.66,14.52 | v57.55,19.75 57.52,19.78 56.6,19.78 56.3,20.07 56.3,20.39 56.81,20.89 59.86,20.89 63.63,17.13 64.42,17.13 64.73,16.82 64.73,15.58 64.32,15.17 64.32,15.13 71.13,8.33 v82.96,8.33
MIC_SCK
  Top 0.3: MK2.4 39.08,25.41 34.92,25.41 34.6,25.09 29.05,25.09 27.77,23.8 21.9,23.8 21.26,23.16 21.26,22.84 U2.16
MIC_SD
  Top 0.3: MK2.6 39.94,24.55 39.94,23.59 39.4,23.06 R_MIC.2 39.3,22.95 37.48,21.14 33.99,21.14 33.47,20.62 33.47,20.01 32.68,19.21 32.68,18.47 32.79,18.36 32.79,17.19 32.57,16.97 32.57,15.37 31.86,14.65 29.9,14.65 29.66,14.9 26.75,14.9 19.98,21.67 19.98,22.74 U2.17
MIC_WS
  Top 0.3: MK2.1 41.01,24.55 41.01,24.23 43.03,22.2 43.03,21.03 42.18,20.18 41.11,20.18 40.13,19.2 40.13,16.42 39.19,15.48 39.19,14.3 38.66,13.77 29.78,13.77 29.42,13.41 26.74,13.41 21.68,18.47 21.38,18.47 18.7,21.16 18.7,22.74 U2.18
MISO  (via drill 0.3)
  Top 0.3: D5.1 38.44,17.83 38.55,17.93 38.55,19.11 R6.1 38.66,19.32 38.66,19.75 v38.98,20.07 | U1.2 58.41,18.36 58.41,19.73 v56.05,22.09 | v41.33,19.64 42.29,19.64 48.37,25.73 JP2.3 48.31,25.54 51.24,22.61 v52.15,22.61 | 19.5,10.09 v21.04,8.54 | 19.5,10.09 7.27,22.31 7.27,22.74 U2.27 | v27.55,6.94 28.2,6.3 28.2,5.87 J1.P7 | 19.5,10.09 21.36,11.96 21.79,11.96 23.89,9.85 36.5,9.85 36.58,9.93 37.02,9.93 37.13,9.81 37.58,9.81 38.27,10.5 38.27,12.02 38.58,12.33 39.14,12.33 v40.26,13.45
  Bottom 0.3: v38.98,20.07 40.9,20.07 v41.33,19.64 41.33,19.29 41.22,19.19 41.22,17.21 42.32,16.11 43.37,16.11 44.1,15.37 44.1,14.52 43.03,13.45 42.31,13.45 v40.26,13.45 | v21.04,8.54 25.95,8.54 v27.55,6.94 | v56.05,22.09 56.16,22.09 56.06,22.19 52.58,22.19 v52.15,22.61
MOSI  (via drill 0.3)
  Top 0.3: U2.7 13.57,5.23 13.57,4.91 15.49,2.99 v15.49,2.7 | v33.21,18.68 33.21,18.25 33.64,17.83 D4.1 | v55.84,11.42 55.84,10.57 U1.5 | v32.57,6.94 32.57,5.87 J1.P3 32.57,5.76 32.57,4.72 30.64,2.79 v30.64,2.7 | v45.63,20.89 45.02,20.28 44.41,20.28 41.22,17.09 41.22,16.12 v41.1,16 | R5.1 35.34,19.11 v35.98,19.11 v35.98,19.1
  Bottom 0.3: v35.99,19.11 33.64,19.11 v33.21,18.68 | 37.75,14.36 35.99,16.12 v35.99,19.11 | 37.75,14.36 38.87,13.24 | JP2.4 50.83,25.94 50.83,25.89 45.83,20.89 v45.63,20.89 | 38.87,13.24 v32.57,6.94 | 37.75,14.36 39.4,16 v41.1,16 | v35.99,19.11 v35.98,19.1 | v15.49,2.7 15.57,2.77 30.56,2.77 v30.64,2.7 | 38.87,13.24 40.77,11.33 47.18,11.33 47.4,11.11 51.02,11.11 51.53,10.59 52.49,10.59 53.32,11.42 v55.84,11.42
N$1
  Top 0.3: R2-USB.1 85.2,14.52 86.37,14.52 87.55,15.69 88.3,15.69 J2.B5
N$2
  Top 0.3: C_DELAY.1 78.26,8.97 80.82,8.97 81.04,9.18 IC1.5
N$3
  Top 0.3: C1_BAT1.1 74.31,22.1 74.63,22.1 75.16,21.56 76.23,21.56 D2.1 76.27,22.21
  Top 0.305: Q1.2 80.6,24.19 80.6,23.2 79.4,23.2 | 79.4,23.2 IC4.3 | 76.27,22.21 77.26,23.2 IC4.1 77.45,23.39 78.13,24.08 79.02,24.08 79.02,23.66 79.4,23.28 79.4,23.2
N$4
  Top 0.3: R1-USB.1 85.2,11.53 86.48,11.53 87.66,12.7 88.3,12.7 J2.A5
N$13
  Top 0.3: R2_BAT.2 74.2,20.5 74.2,15.27 74.1,15.16 MCP73831.5
N$14  (via drill 0.3)
  Top 0.3: v77.41,19 77.94,18.47 78.16,18.47 R1_BAT.1 | v75.27,17.83 75.27,16.44 74.63,15.8 74.63,13.45 74.1,12.92 74.1,12.6 MCP73831.1
  Bottom 0.3: v77.41,19 76.45,19 v75.27,17.83
N$15  (via drill 0.3)
  Top 0.3: v80.82,26.26 81.14,26.58 81.57,26.58 CHG_LED.C | v78.9,17.83 78.26,17.19 R1_BAT.2
  Bottom 0.3: v80.82,26.26 81.62,25.46 81.62,20.55 v78.9,17.83
NEOPIXEL  (via drill 0.3)
  Top 0.3: v78.58,2.78 80.82,2.78 LED1.3 | v34.39,25.62 32.04,25.62 31.93,25.51 30.44,25.51 28.84,27.11 v26.49,27.11 | v8.45,23.91 8.45,22.84 U2.26
  Bottom 0.3: v34.39,25.62 37.7,22.31 40.04,22.31 46.98,15.37 58.84,15.37 63.75,10.46 65.43,10.46 73.12,2.78 v78.58,2.78 | v26.49,27.11 11.65,27.11 v8.45,23.91
RESET  (via drill 0.3)
  Top 0.3: v82,5.23 81.14,6.08 81.14,6.3 IC1.1 | v82.85,4.38 86.16,4.38 86.27,4.48 R_RESET.2 86.48,4.59 87.97,4.59 C5.1 87.97,4.48 89.26,3.2 RESET_BUTTON.4 89.15,3.1 88.51,2.46 88.51,0.96 88.72,0.75 94.06,0.75 94.17,0.85 94.17,2.24 93.53,2.88 93.53,3.1 RESET_BUTTON.3 | v65.01,11.42 65.01,11.1 64.53,10.63 62.55,10.63 61.73,9.8 61.73,9.78 61.61,9.66 v61.61,8.22 | U2.3 9.02,4.71 9.02,4.38 11.69,1.72 v14.64,1.72 | v46.88,5.1 44.44,5.1 44.42,5.07 43.12,5.07 v41.71,3.66
  Bottom 0.3: v82.85,4.38 v82,5.23 73.24,5.23 67.05,11.42 v65.01,11.42 | v14.64,1.72 41.23,1.72 41.71,2.2 v41.71,3.66 | v61.61,8.22 55.52,8.22 52.29,4.99 48.94,4.99 48.83,5.1 v46.88,5.1
SCK  (via drill 0.3)
  Top 0.3: U2.6 12.4,5.23 12.4,4.8 15.49,1.71 27.34,1.71 30.33,4.7 30.33,5.76 J1.P5 30.44,5.87 v30.44,7.26 | D3.1 31.93,17.83 31.93,19.11 R4.1 31.93,19.32 32.47,19.86 v32.57,19.86 | U1.6 57.12,10.57 57.12,10.89 55.63,12.38 55.57,12.38 54.36,13.6 54.36,16.89 53.67,17.58 53.67,18.29 v53.17,18.79 48.17,18.79 48.05,18.67 45.22,15.85 44.23,15.85 44.09,15.99 42.58,15.99 40.68,14.09 40.15,14.09 39.3,13.24 v37.91,13.24 37.29,13.24 34.83,10.78 v30.86,10.78
  Bottom 0.3: JP2.5 53.49,25.94 51.65,24.1 51.65,22.2 53.17,20.68 v53.17,18.79 | v32.57,19.86 32.57,18.57 v37.91,13.24 | v30.44,7.26 30.44,10.36 v30.86,10.78
SCL  (via drill 0.3, 0.35)
  Top 0.3: U2.20 16.13,22.84 16.13,23.16 17.2,24.23 25.1,24.23 26.17,25.3 27.02,25.3 LED2.4 27.23,25.3 v28.52,25.3 | SENSOR2.4 74.31,3.42 72.39,3.42 71.38,4.43 69.27,4.43 v68.92,4.78 | J3.4 32.57,23.06 32.57,21.45 v32.5,21.38 | JP1.12 43.14,2.13 41.48,2.13 40.18,3.44 40.18,5.67 40.15,5.7 v40.15,6.01 | v38.98,10.46 38.98,11.23 39.33,11.58 39.33,11.7 42.57,14.95 42.93,14.95 U$1.P$3 43.14,15.05 45.04,15.05 47.05,17.07 49.2,17.07 49.6,17.07 | v65.4,16 65.6,15.8 66.4,15.8 68.4,15.8 69.85,14.35 69.85,9.45 v67.4,7 | U3.7 65.7,17.35 v65.67,17.33 | R2-PINH.1 52.11,10.84 v52.11,11.72 | U4.13 49,15.85 49.33,16.18 49.6,16.45 49.6,17.07 | v52.58,13.92 52.58,14.81 52.55,14.84 52.55,15.46 51.08,16.93 50.94,17.07 49.6,17.07
  Bottom 0.3: v52.58,13.92 53.98,12.52 53.98,12.38 | 53.98,12.38 52.58,12.38 52.11,12.38 v52.11,11.72 | 53.98,12.38 60.22,12.38 62.57,10.03 62.83,10.03 66.03,6.83 | v38.98,10.46 41.35,8.09 41.35,7.29 40.15,6.09 v40.15,6.01 | 66.03,6.83 67.38,5.48 67.49,5.48 68.19,4.78 v68.92,4.78 | U$1.P$3 42.38,15.68 42.14,15.68 39.45,18.37 37.42,18.37 36.19,19.61 35.41,19.61 35.38,19.57 34.02,19.57 32.56,21.03 32.5,21.1 v32.5,21.38 30.82,21.38 30.8,21.4 30.4,21.8 30.4,23.2 30.4,23.42 v28.52,25.3 | 66.03,6.83 67.23,6.83 v67.4,7 | v65.67,17.33 65.4,17.05 v65.4,16
SD_CS  (via drill 0.3)
  Top 0.3: R3.1 28.41,19.11 28.41,18.89 27.34,17.83 D7.1 27.13,17.72 v26.49,17.08 | v18.7,9.29 18.7,5.34 U2.11 | v34.49,7.04 33.75,6.3 J1.P2 | v40.36,15.16 40.36,16.01 40.79,16.44 40.79,17.27 44.92,21.39 46.56,21.39 47.08,20.87 51.05,20.87 51.58,21.4 51.65,21.4 55.84,25.59 55.84,25.94 JP2.6 | v40.9,11.96 40.9,10.99 38.76,8.86 v38.76,8.75
  Bottom 0.3: v26.49,17.08 20.78,11.37 | 20.78,11.37 v18.7,9.29 | 20.78,11.37 21.26,10.89 26.06,10.89 30.97,5.98 33,5.98 34.07,7.04 v34.49,7.04 34.6,7.04 36.31,8.75 v38.76,8.75 | v40.36,15.16 40.36,14.3 39.72,13.66 39.72,13.13 v40.9,11.96
SDA  (via drill 0.3, 0.35)
  Top 0.3: R1_PINH.1 52.11,8.86 51.47,9.5 51.47,11.37 v51.45,11.39 | JP1.11 45.81,2.13 49.15,5.48 49.16,5.48 v49.18,5.49 | v28.62,26.58 27.13,26.58 LED2.6 | v75.27,3.31 75.27,3.2 74.74,2.67 74.42,2.67 SENSOR2.3 | v34.39,24.55 33.53,23.7 33.53,23.16 J3.3 | U2.19 17.41,22.74 17.41,21.84 21.2,18.05 21.25,18.05 v25.1,14.2 | v57.02,20.39 54.32,20.39 54.27,20.34 47,20.34 46.62,20.73 46.18,20.73 45.87,20.42 45.87,20.33 U$1.P$4 | v64,15.97 64.1,16.07 64.42,16.07 65.14,16.8 65.89,16.8 65.94,16.85 U3.8 | v50.2,16.4 51,16.4 52,15.4 52,14.6 51.67,14.27 v51.67,14.13 | v48.8,16.4 48.5,16.1 U4.14
  Bottom 0.3: 49.51,8.89 48.49,7.87 48.49,6.15 49.18,5.46 v49.18,5.49 | 34.55,24.71 38.66,20.6 41.11,20.6 43.03,18.68 43.03,17.61 U$1.P$4 | 34.55,24.71 32.68,26.58 v28.62,26.58 28.62,26.47 27.98,25.83 27.98,24.63 29.97,22.64 29.97,21.62 30.12,21.48 30.12,19.21 26.65,15.75 | 34.55,24.71 v34.39,24.55 | 26.65,15.75 v25.1,14.2 | 26.65,15.75 31.4,10.99 31.4,7.37 32.36,6.41 32.79,6.41 33.11,6.72 33.11,6.83 37.24,10.96 40.54,10.96 40.6,10.91 47,10.91 47.23,10.68 47.72,10.68 49.51,8.89 | 61.5,16.05 61.5,18.65 59.9,20.25 57.16,20.25 v57.02,20.39 | v75.27,3.31 73.19,3.31 65.61,10.89 64.6,10.89 62.21,13.27 62.21,15.34 61.5,16.05 | 61.5,16.05 63.91,16.05 v64,15.97 | 49.51,8.89 50.11,8.89 51.38,10.17 52.67,10.17 52.93,10.43 55.56,10.43 56.35,11.21 56.35,11.63 56.05,11.93 53.22,11.93 52.32,11.02 51.9,11.02 51.6,11.31 | v51.45,11.39 51.6,11.54 51.6,14.05 v51.67,14.13 | v50.2,16.4 v48.8,16.4
  Bottom 0.305: v51.45,11.39 51.53,11.39 51.6,11.31
UART_RX  (via drill 0.3)
  Top 0.3: U2.24 11.12,22.74 11.12,22.31 21.04,12.38 28.52,12.38 30.62,10.28 36.33,10.28 36.4,10.36 37.2,10.36 37.23,10.32 v37.34,10.32 | v54.78,8.65 54.78,11.17 53.08,12.87 51.47,12.87 50.87,12.27 47.03,12.27 46.43,12.87 44.46,10.91 42.42,10.91 40.57,9.05 40.45,9.05 40.36,8.97 v39.62,8.97
  Bottom 0.3: v39.62,8.97 38.34,10.25 37.41,10.25 v37.34,10.32 | v54.78,8.65 61.29,8.65 61.39,8.75 61.82,8.75 65.98,4.59 65.98,2.13 JP1.3
UART_TX  (via drill 0.3, 0.35)
  Top 0.3: v7.4,18.4 v7.4,8.8 | v10,21 9.75,21.25 U2.25 | v8.23,0.48 8.95,0.48 8.98,0.45 32.95,0.45 39.02,6.52 41.21,6.52 41.35,6.66 48.81,6.66 48.98,6.82 49.42,6.82 49.73,6.51 49.73,6.4 v49.82,6.31
  Bottom 0.3: JP1.2 68.65,2.13 66.95,3.84 66.95,4.27 62.03,9.18 61.11,9.18 61.08,9.16 54.54,9.16 54.24,8.86 54.24,8.22 51.89,5.87 50.35,5.87 49.92,6.31 v49.82,6.31 | v10,21 v7.4,18.4 | v7.4,8.8 5.4,6.8 5.4,1.31 6.23,0.48 v8.23,0.48
USB_D+  (via drill 0.3)
  Top 0.3: v77.19,13.34 80.72,13.34 D1.1 | v23.29,4.7 23.07,4.7 22.54,5.23 U2.14 | v59.58,4.91 62.29,7.63 67.13,7.63 69.37,9.86 69.37,12 69.34,12.03 v69.34,12.49
  Bottom 0.3: v77.19,13.34 76.13,13.34 75.84,13.05 69.91,13.05 v69.34,12.49 | v59.58,4.91 52.82,4.91 52.47,4.56 48.33,4.56 48.3,4.59 33.76,4.59 33.6,4.75 32.8,4.75 32.75,4.7 v23.29,4.7
USB_D-  (via drill 0.3, 0.35)
  Top 0.3: v79.11,11.53 80.72,11.53 D1.3 | v21.58,11.42 21.58,5.66 21.26,5.34 U2.13 | v64.38,14.18 64.8,14.6 64.8,14.91 v65.05,15.15 | v61.71,14.28 61.77,14.28 61.84,14.2 v62.74,14.2
  Bottom 0.3: 47.2,15.8 40.26,22.74 38.21,22.74 33.83,27.11 28.41,27.11 27.55,26.26 27.55,23.16 29.69,21.03 29.69,19.43 24.99,14.73 24.89,14.73 v21.58,11.42 | v64.38,14.18 64.37,14.2 v62.74,14.2 | v65.05,15.15 65.97,15.15 69.13,11.98 78.66,11.98 v79.11,11.53 | 60.19,15.8 v61.71,14.28
  Bottom 0.305: 47.2,15.8 60.19,15.8
VBAT  (via drill 0.3, 0.35)
  Top 0.2: U3.2 U3.3
  Top 0.3: v70.93,17.8 70.48,17.35 U3.2
  Top 0.305: v70.93,17.8 70.6,18.13 C7.1
  Top 0.4: v75.59,13.56 75.91,13.24 75.91,12.6 MCP73831.3 | v70.93,17.8 71.58,17.15 C2_BAT.1 71.2,16.55 71.2,14.32 v71.96,13.56 | v82.42,21.35 82.42,22.94 Q1.3
  Bottom 0.4: v75.59,13.56 v71.96,13.56 | 82.42,19.86 v82.42,21.35 | 82.42,19.86 87.66,14.62 BT1.P | 70.94,18.74 72.5,17.19 79.76,17.19 82.42,19.86 | 70.94,18.74 66.09,23.59 66.09,25.94 JP2.10 | 70.94,18.74 70.94,18.14 70.93,18.13 v70.93,17.8
VBUS
  Top 0.4: 76.55,11.74 76.34,11.53 73.68,11.53 73.43,11.79 C1_BAT.1 | 76.55,11.74 76.55,14.52 76.02,15.05 MCP73831.4 76.02,15.27 77.41,16.65 77.41,17.72 76.77,18.36 R1_PWRUSB.2 76.66,18.47 76.66,19.75 D2.2 78.47,21.35 80.72,21.35 81.78,20.28 PFMF.050.1.1 | D1.5 83.17,12.38 82.74,12.38 81.68,11.32 81.68,10.99 81.46,10.78 79.01,10.78 78.16,11.64 76.66,11.64 76.55,11.74 | C5_USB.1 85.95,17.19 84.45,17.19 C4_USB.1 84.24,17.19 82,19.43 82,20.07 PFMF.050.1.1 | PFMF.050.1.1 82.1,20.18 83.28,21.35 83.28,24.87 Q1.1 83.28,25.09 83.17,25.19 83.17,26.58 CHG_LED.A 82.96,26.69 82.32,27.33 73.67,27.33 72.39,26.05 71.22,26.05 JP2.12
VUSB
  Top 0.3: J2.B9 88.5,11.77 88.99,11.77 89.72,12.51 89.72,15.53 89.07,16.19 88.5,16.19 J2.B4
  Top 0.4: J2.A9 88.3,16.55 88.3,16.33 J2.B4 88.19,16.33 82.64,16.33 82,15.69 PFMF.050.1.2 | J2.A4 88.3,11.53 88.3,11.74 J2.B9

## Text on the board
gafi_layer: LTR308 | MIC | 3V3 | GND | MISO / | IO2 | MOSI / | IO7 | SCK / | IO6 | SD_CS / | IO10 | FLASH_CS / | IO23 | GND | GND | VBAT | 3V3 | 5V | BOOT/IO9 | Qwiic / Stemma QT | LSM6DSL | SCL / | IO22 | SDA / | IO21 | GND | GND | IO8 | IO5 | IO1 | IO0 | GND | RX / | IO17 | TX / | IO16 | 3V3 | RESET | BME688 | ESP32 Sparrow v3.2 | GAFI